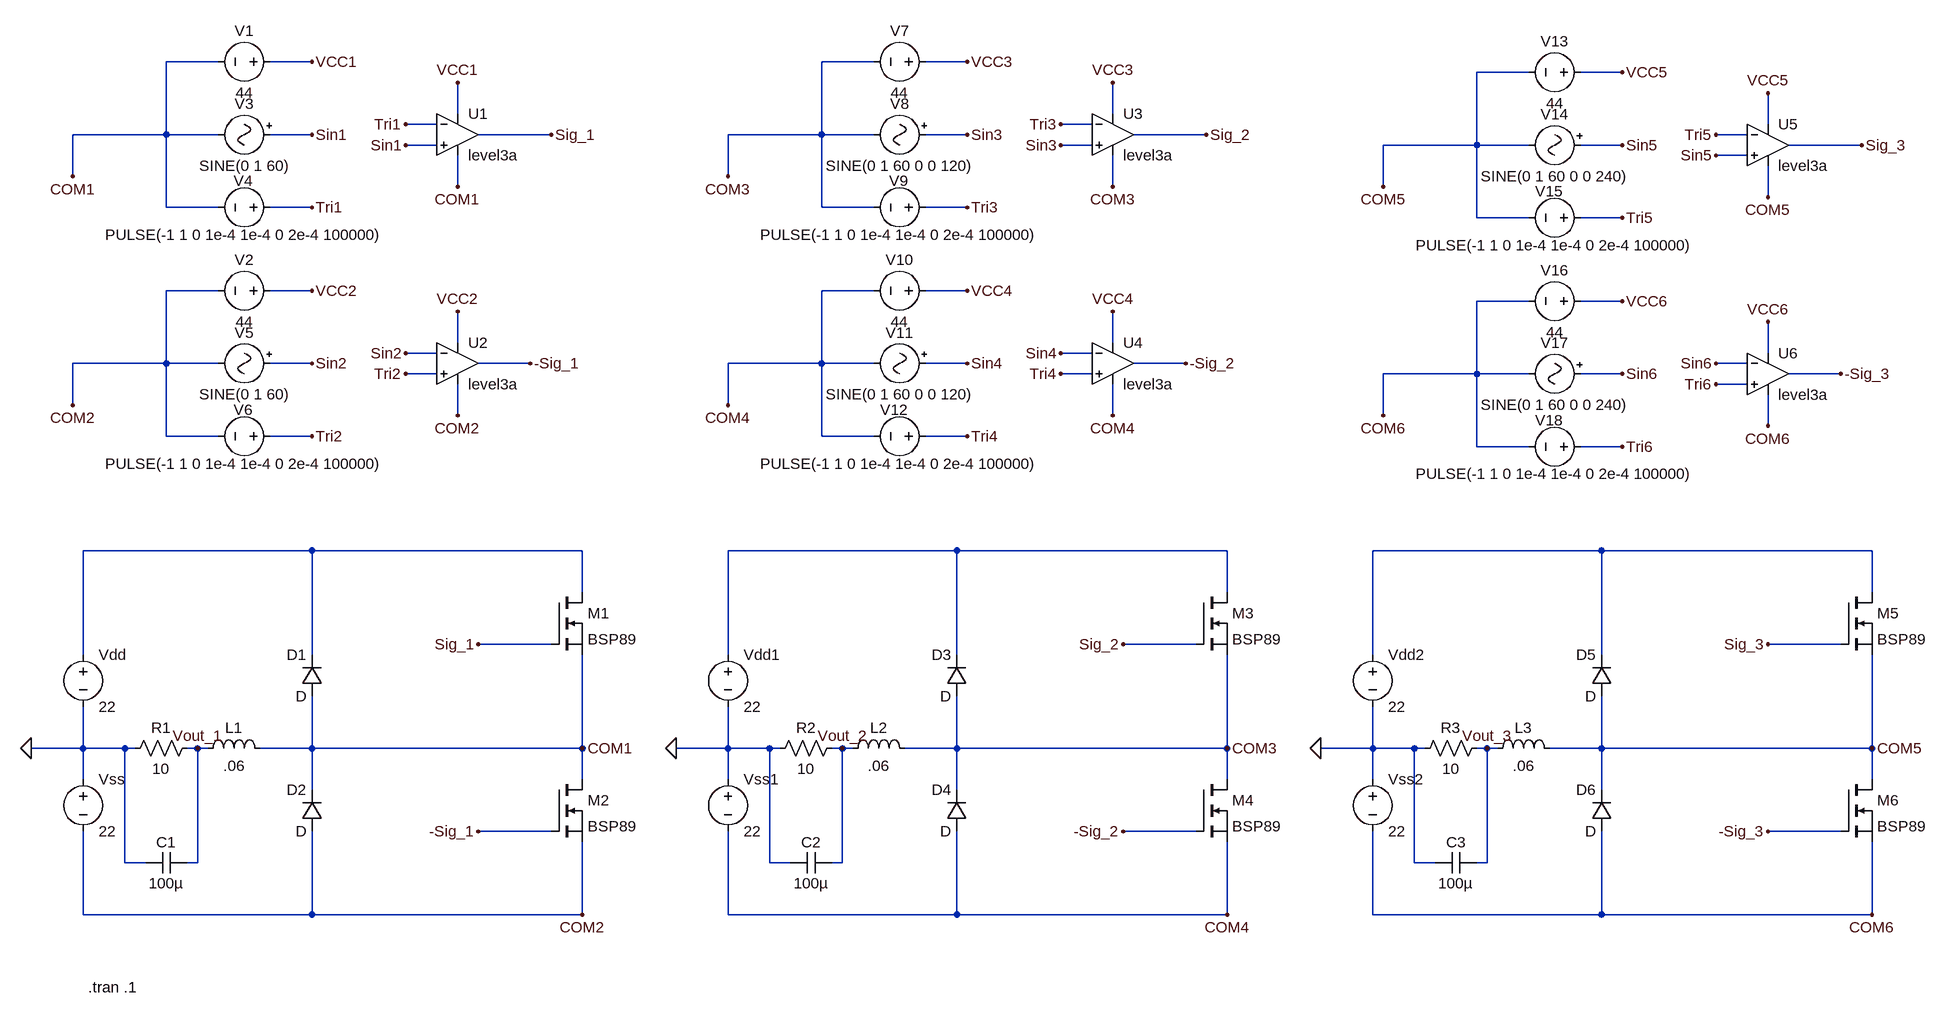
[diagram p0: schematic working_three_phase_inv_w9.asc]
working_three_phase_inv_w9.asc, the LTspice schematic file:
Version 4
SHEET 1 2928 2500
WIRE 272 352 192 352
WIRE 416 352 352 352
WIRE 1280 352 1200 352
WIRE 1424 352 1360 352
WIRE 2288 368 2208 368
WIRE 2432 368 2368 368
WIRE 640 432 640 384
WIRE 1648 432 1648 384
WIRE 608 448 560 448
WIRE 1616 448 1568 448
WIRE 2656 448 2656 400
WIRE 192 464 192 352
WIRE 192 464 48 464
WIRE 272 464 192 464
WIRE 416 464 352 464
WIRE 784 464 672 464
WIRE 1200 464 1200 352
WIRE 1200 464 1056 464
WIRE 1280 464 1200 464
WIRE 1424 464 1360 464
WIRE 1792 464 1680 464
WIRE 2624 464 2576 464
WIRE 608 480 560 480
WIRE 1616 480 1568 480
WIRE 2208 480 2208 368
WIRE 2208 480 2064 480
WIRE 2288 480 2208 480
WIRE 2432 480 2368 480
WIRE 2800 480 2688 480
WIRE 2624 496 2576 496
WIRE 48 528 48 464
WIRE 1056 528 1056 464
WIRE 640 544 640 496
WIRE 1648 544 1648 496
WIRE 2064 544 2064 480
WIRE 2656 560 2656 512
WIRE 192 576 192 464
WIRE 272 576 192 576
WIRE 416 576 352 576
WIRE 1200 576 1200 464
WIRE 1280 576 1200 576
WIRE 1424 576 1360 576
WIRE 2208 592 2208 480
WIRE 2288 592 2208 592
WIRE 2432 592 2368 592
WIRE 272 704 192 704
WIRE 416 704 352 704
WIRE 1280 704 1200 704
WIRE 1424 704 1360 704
WIRE 2288 720 2208 720
WIRE 2432 720 2368 720
WIRE 640 784 640 736
WIRE 1648 784 1648 736
WIRE 608 800 560 800
WIRE 1616 800 1568 800
WIRE 2656 800 2656 752
WIRE 192 816 192 704
WIRE 192 816 48 816
WIRE 272 816 192 816
WIRE 416 816 352 816
WIRE 752 816 672 816
WIRE 1200 816 1200 704
WIRE 1200 816 1056 816
WIRE 1280 816 1200 816
WIRE 1424 816 1360 816
WIRE 1760 816 1680 816
WIRE 2624 816 2576 816
WIRE 608 832 560 832
WIRE 1616 832 1568 832
WIRE 2208 832 2208 720
WIRE 2208 832 2064 832
WIRE 2288 832 2208 832
WIRE 2432 832 2368 832
WIRE 2768 832 2688 832
WIRE 2624 848 2576 848
WIRE 48 880 48 816
WIRE 1056 880 1056 816
WIRE 640 896 640 848
WIRE 1648 896 1648 848
WIRE 2064 896 2064 832
WIRE 2656 912 2656 864
WIRE 192 928 192 816
WIRE 272 928 192 928
WIRE 416 928 352 928
WIRE 1200 928 1200 816
WIRE 1280 928 1200 928
WIRE 1424 928 1360 928
WIRE 2208 944 2208 832
WIRE 2288 944 2208 944
WIRE 2432 944 2368 944
WIRE 416 1104 64 1104
WIRE 832 1104 416 1104
WIRE 1408 1104 1056 1104
WIRE 1824 1104 1408 1104
WIRE 2400 1104 2048 1104
WIRE 2816 1104 2400 1104
WIRE 832 1168 832 1104
WIRE 1824 1168 1824 1104
WIRE 2816 1168 2816 1104
WIRE 784 1248 672 1248
WIRE 1776 1248 1664 1248
WIRE 2768 1248 2656 1248
WIRE 64 1264 64 1104
WIRE 416 1264 416 1104
WIRE 1056 1264 1056 1104
WIRE 1408 1264 1408 1104
WIRE 2048 1264 2048 1104
WIRE 2400 1264 2400 1104
WIRE 64 1408 64 1344
WIRE 64 1408 -16 1408
WIRE 128 1408 64 1408
WIRE 144 1408 128 1408
WIRE 240 1408 224 1408
WIRE 256 1408 240 1408
WIRE 416 1408 416 1328
WIRE 416 1408 336 1408
WIRE 832 1408 832 1264
WIRE 832 1408 416 1408
WIRE 1056 1408 1056 1344
WIRE 1056 1408 976 1408
WIRE 1120 1408 1056 1408
WIRE 1136 1408 1120 1408
WIRE 1232 1408 1216 1408
WIRE 1248 1408 1232 1408
WIRE 1408 1408 1408 1328
WIRE 1408 1408 1328 1408
WIRE 1824 1408 1824 1264
WIRE 1824 1408 1408 1408
WIRE 2048 1408 2048 1344
WIRE 2048 1408 1968 1408
WIRE 2112 1408 2048 1408
WIRE 2128 1408 2112 1408
WIRE 2224 1408 2208 1408
WIRE 2240 1408 2224 1408
WIRE 2400 1408 2400 1328
WIRE 2400 1408 2320 1408
WIRE 2816 1408 2816 1264
WIRE 2816 1408 2400 1408
WIRE 64 1456 64 1408
WIRE 832 1456 832 1408
WIRE 1056 1456 1056 1408
WIRE 1824 1456 1824 1408
WIRE 2048 1456 2048 1408
WIRE 2816 1456 2816 1408
WIRE 416 1472 416 1408
WIRE 1408 1472 1408 1408
WIRE 2400 1472 2400 1408
WIRE 784 1536 672 1536
WIRE 1776 1536 1664 1536
WIRE 2768 1536 2656 1536
WIRE 128 1584 128 1408
WIRE 160 1584 128 1584
WIRE 240 1584 240 1408
WIRE 240 1584 224 1584
WIRE 1120 1584 1120 1408
WIRE 1152 1584 1120 1584
WIRE 1232 1584 1232 1408
WIRE 1232 1584 1216 1584
WIRE 2112 1584 2112 1408
WIRE 2144 1584 2112 1584
WIRE 2224 1584 2224 1408
WIRE 2224 1584 2208 1584
WIRE 64 1664 64 1536
WIRE 416 1664 416 1536
WIRE 416 1664 64 1664
WIRE 832 1664 832 1552
WIRE 832 1664 416 1664
WIRE 1056 1664 1056 1536
WIRE 1408 1664 1408 1536
WIRE 1408 1664 1056 1664
WIRE 1824 1664 1824 1552
WIRE 1824 1664 1408 1664
WIRE 2048 1664 2048 1536
WIRE 2400 1664 2400 1536
WIRE 2400 1664 2048 1664
WIRE 2816 1664 2816 1552
WIRE 2816 1664 2400 1664
FLAG -16 1408 0
FLAG 560 480 Sin1
FLAG 560 448 Tri1
FLAG 560 832 Tri2
FLAG 560 800 Sin2
FLAG 784 464 Sig_1
FLAG 752 816 -Sig_1
FLAG 640 384 VCC1
FLAG 640 736 VCC2
FLAG 640 544 COM1
FLAG 640 896 COM2
FLAG 832 1408 COM1
FLAG 832 1664 COM2
FLAG 416 352 VCC1
FLAG 416 464 Sin1
FLAG 416 576 Tri1
FLAG 48 528 COM1
FLAG 240 1408 Vout_1
FLAG 416 704 VCC2
FLAG 416 816 Sin2
FLAG 416 928 Tri2
FLAG 48 880 COM2
FLAG 672 1248 Sig_1
FLAG 672 1536 -Sig_1
FLAG 976 1408 0
FLAG 1824 1408 COM3
FLAG 1824 1664 COM4
FLAG 1232 1408 Vout_2
FLAG 1664 1248 Sig_2
FLAG 1664 1536 -Sig_2
FLAG 1568 480 Sin3
FLAG 1568 448 Tri3
FLAG 1568 832 Tri4
FLAG 1568 800 Sin4
FLAG 1792 464 Sig_2
FLAG 1760 816 -Sig_2
FLAG 1648 384 VCC3
FLAG 1648 736 VCC4
FLAG 1648 544 COM3
FLAG 1648 896 COM4
FLAG 1424 352 VCC3
FLAG 1424 464 Sin3
FLAG 1424 576 Tri3
FLAG 1056 528 COM3
FLAG 1424 704 VCC4
FLAG 1424 816 Sin4
FLAG 1424 928 Tri4
FLAG 1056 880 COM4
FLAG 2576 496 Sin5
FLAG 2576 464 Tri5
FLAG 2576 848 Tri6
FLAG 2576 816 Sin6
FLAG 2800 480 Sig_3
FLAG 2768 832 -Sig_3
FLAG 2656 400 VCC5
FLAG 2656 752 VCC6
FLAG 2656 560 COM5
FLAG 2656 912 COM6
FLAG 2432 368 VCC5
FLAG 2432 480 Sin5
FLAG 2432 592 Tri5
FLAG 2064 544 COM5
FLAG 2432 720 VCC6
FLAG 2432 832 Sin6
FLAG 2432 944 Tri6
FLAG 2064 896 COM6
FLAG 1968 1408 0
FLAG 2816 1408 COM5
FLAG 2816 1664 COM6
FLAG 2224 1408 Vout_3
FLAG 2656 1248 Sig_3
FLAG 2656 1536 -Sig_3
SYMBOL voltage 64 1248 R0
SYMATTR InstName Vdd
SYMATTR Value 22
SYMBOL voltage 64 1440 R0
SYMATTR InstName Vss
SYMATTR Value 22
SYMBOL Diode 432 1328 R180
WINDOW 0 24 64 Left 2
WINDOW 3 24 0 Left 2
SYMATTR InstName D1
SYMBOL Diode 432 1536 R180
WINDOW 0 24 64 Left 2
WINDOW 3 24 0 Left 2
SYMATTR InstName D2
SYMBOL nmos 784 1168 R0
SYMATTR InstName M1
SYMATTR Value BSP89
SYMBOL nmos 784 1456 R0
SYMATTR InstName M2
SYMATTR Value BSP89
SYMBOL Res 240 1392 R90
WINDOW 0 0 56 VBottom 2
WINDOW 3 32 56 VTop 2
SYMATTR InstName R1
SYMATTR Value 10
SYMBOL ind 240 1424 R270
WINDOW 0 32 56 VTop 2
WINDOW 3 5 56 VBottom 2
SYMATTR InstName L1
SYMATTR Value .06
SYMBOL cap 224 1568 R90
WINDOW 0 0 32 VBottom 2
WINDOW 3 32 32 VTop 2
SYMATTR InstName C1
SYMATTR Value 100µ
SYMBOL voltage 368 352 R90
WINDOW 0 -32 56 VBottom 2
WINDOW 3 32 56 VTop 2
WINDOW 123 0 0 Left 0
WINDOW 39 0 0 Left 0
SYMATTR InstName V1
SYMATTR Value 44
SYMBOL signal 368 464 R90
WINDOW 0 -32 56 VBottom 2
WINDOW 3 32 56 VTop 2
WINDOW 123 0 0 Left 0
WINDOW 39 0 0 Left 0
SYMATTR InstName V3
SYMATTR Value SINE(0 1 60)
SYMBOL voltage 368 576 R90
WINDOW 123 0 0 Left 0
WINDOW 39 0 0 Left 0
WINDOW 0 -41 43 VRight 2
WINDOW 3 42 -161 VRight 2
SYMATTR InstName V4
SYMATTR Value PULSE(-1 1 0 1e-4 1e-4 0 2e-4 100000)
SYMBOL voltage 368 704 R90
WINDOW 0 -32 56 VBottom 2
WINDOW 3 32 56 VTop 2
WINDOW 123 0 0 Left 0
WINDOW 39 0 0 Left 0
SYMATTR InstName V2
SYMATTR Value 44
SYMBOL signal 368 816 R90
WINDOW 0 -32 56 VBottom 2
WINDOW 3 32 56 VTop 2
WINDOW 123 0 0 Left 0
WINDOW 39 0 0 Left 0
SYMATTR InstName V5
SYMATTR Value SINE(0 1 60)
SYMBOL voltage 368 928 R90
WINDOW 123 0 0 Left 0
WINDOW 39 0 0 Left 0
WINDOW 0 -41 43 VRight 2
WINDOW 3 42 -161 VRight 2
SYMATTR InstName V6
SYMATTR Value PULSE(-1 1 0 1e-4 1e-4 0 2e-4 100000)
SYMBOL OpAmps/UniversalOpAmp3 640 464 R0
SYMATTR InstName U1
SYMBOL OpAmps/UniversalOpAmp3 640 816 R0
SYMATTR InstName U2
SYMBOL voltage 1056 1248 R0
SYMATTR InstName Vdd1
SYMATTR Value 22
SYMBOL voltage 1056 1440 R0
SYMATTR InstName Vss1
SYMATTR Value 22
SYMBOL Diode 1424 1328 R180
WINDOW 0 24 64 Left 2
WINDOW 3 24 0 Left 2
SYMATTR InstName D3
SYMBOL Diode 1424 1536 R180
WINDOW 0 24 64 Left 2
WINDOW 3 24 0 Left 2
SYMATTR InstName D4
SYMBOL nmos 1776 1168 R0
SYMATTR InstName M3
SYMATTR Value BSP89
SYMBOL nmos 1776 1456 R0
SYMATTR InstName M4
SYMATTR Value BSP89
SYMBOL Res 1232 1392 R90
WINDOW 0 0 56 VBottom 2
WINDOW 3 32 56 VTop 2
SYMATTR InstName R2
SYMATTR Value 10
SYMBOL ind 1232 1424 R270
WINDOW 0 32 56 VTop 2
WINDOW 3 5 56 VBottom 2
SYMATTR InstName L2
SYMATTR Value .06
SYMBOL cap 1216 1568 R90
WINDOW 0 0 32 VBottom 2
WINDOW 3 32 32 VTop 2
SYMATTR InstName C2
SYMATTR Value 100µ
SYMBOL voltage 1376 352 R90
WINDOW 0 -32 56 VBottom 2
WINDOW 3 32 56 VTop 2
WINDOW 123 0 0 Left 0
WINDOW 39 0 0 Left 0
SYMATTR InstName V7
SYMATTR Value 44
SYMBOL signal 1376 464 R90
WINDOW 0 -32 56 VBottom 2
WINDOW 3 32 56 VTop 2
WINDOW 123 0 0 Left 0
WINDOW 39 0 0 Left 0
SYMATTR InstName V8
SYMATTR Value SINE(0 1 60 0 0 120)
SYMBOL voltage 1376 576 R90
WINDOW 123 0 0 Left 0
WINDOW 39 0 0 Left 0
WINDOW 0 -41 43 VRight 2
WINDOW 3 42 -161 VRight 2
SYMATTR InstName V9
SYMATTR Value PULSE(-1 1 0 1e-4 1e-4 0 2e-4 100000)
SYMBOL voltage 1376 704 R90
WINDOW 0 -32 56 VBottom 2
WINDOW 3 32 56 VTop 2
WINDOW 123 0 0 Left 0
WINDOW 39 0 0 Left 0
SYMATTR InstName V10
SYMATTR Value 44
SYMBOL signal 1376 816 R90
WINDOW 0 -32 56 VBottom 2
WINDOW 3 32 56 VTop 2
WINDOW 123 0 0 Left 0
WINDOW 39 0 0 Left 0
SYMATTR InstName V11
SYMATTR Value SINE(0 1 60 0 0 120)
SYMBOL voltage 1376 928 R90
WINDOW 123 0 0 Left 0
WINDOW 39 0 0 Left 0
WINDOW 0 -41 43 VRight 2
WINDOW 3 42 -161 VRight 2
SYMATTR InstName V12
SYMATTR Value PULSE(-1 1 0 1e-4 1e-4 0 2e-4 100000)
SYMBOL OpAmps/UniversalOpAmp3 1648 464 R0
SYMATTR InstName U3
SYMBOL OpAmps/UniversalOpAmp3 1648 816 R0
SYMATTR InstName U4
SYMBOL voltage 2384 368 R90
WINDOW 0 -32 56 VBottom 2
WINDOW 3 32 56 VTop 2
WINDOW 123 0 0 Left 0
WINDOW 39 0 0 Left 0
SYMATTR InstName V13
SYMATTR Value 44
SYMBOL signal 2384 480 R90
WINDOW 0 -32 56 VBottom 2
WINDOW 3 32 56 VTop 2
WINDOW 123 0 0 Left 0
WINDOW 39 0 0 Left 0
SYMATTR InstName V14
SYMATTR Value SINE(0 1 60 0 0 240)
SYMBOL voltage 2384 592 R90
WINDOW 123 0 0 Left 0
WINDOW 39 0 0 Left 0
WINDOW 0 -41 43 VRight 2
WINDOW 3 42 -161 VRight 2
SYMATTR InstName V15
SYMATTR Value PULSE(-1 1 0 1e-4 1e-4 0 2e-4 100000)
SYMBOL voltage 2384 720 R90
WINDOW 0 -32 56 VBottom 2
WINDOW 3 32 56 VTop 2
WINDOW 123 0 0 Left 0
WINDOW 39 0 0 Left 0
SYMATTR InstName V16
SYMATTR Value 44
SYMBOL signal 2384 832 R90
WINDOW 0 -32 56 VBottom 2
WINDOW 3 32 56 VTop 2
WINDOW 123 0 0 Left 0
WINDOW 39 0 0 Left 0
SYMATTR InstName V17
SYMATTR Value SINE(0 1 60 0 0 240)
SYMBOL voltage 2384 944 R90
WINDOW 123 0 0 Left 0
WINDOW 39 0 0 Left 0
WINDOW 0 -41 43 VRight 2
WINDOW 3 42 -161 VRight 2
SYMATTR InstName V18
SYMATTR Value PULSE(-1 1 0 1e-4 1e-4 0 2e-4 100000)
SYMBOL OpAmps/UniversalOpAmp3 2656 480 R0
SYMATTR InstName U5
SYMBOL OpAmps/UniversalOpAmp3 2656 832 R0
SYMATTR InstName U6
SYMBOL voltage 2048 1248 R0
SYMATTR InstName Vdd2
SYMATTR Value 22
SYMBOL voltage 2048 1440 R0
SYMATTR InstName Vss2
SYMATTR Value 22
SYMBOL Diode 2416 1328 R180
WINDOW 0 24 64 Left 2
WINDOW 3 24 0 Left 2
SYMATTR InstName D5
SYMBOL Diode 2416 1536 R180
WINDOW 0 24 64 Left 2
WINDOW 3 24 0 Left 2
SYMATTR InstName D6
SYMBOL nmos 2768 1168 R0
SYMATTR InstName M5
SYMATTR Value BSP89
SYMBOL nmos 2768 1456 R0
SYMATTR InstName M6
SYMATTR Value BSP89
SYMBOL Res 2224 1392 R90
WINDOW 0 0 56 VBottom 2
WINDOW 3 32 56 VTop 2
SYMATTR InstName R3
SYMATTR Value 10
SYMBOL ind 2224 1424 R270
WINDOW 0 32 56 VTop 2
WINDOW 3 5 56 VBottom 2
SYMATTR InstName L3
SYMATTR Value .06
SYMBOL cap 2208 1568 R90
WINDOW 0 0 32 VBottom 2
WINDOW 3 32 32 VTop 2
SYMATTR InstName C3
SYMATTR Value 100µ
TEXT 72 1776 Left 2 !.tran .1

The netlist it stands for:
* working_three_phase_inv_w9.asc
Vdd N001 0 22
Vss 0 COM2 22
D1 COM1 N001 D
D2 COM2 COM1 D
M1 N001 Sig_1 COM1 COM1 BSP89
M2 COM1 -Sig_1 COM2 COM2 BSP89
R1 Vout_1 0 10
L1 Vout_1 COM1 .06
C1 Vout_1 0 100µ
V1 VCC1 COM1 44
V3 Sin1 COM1 SINE(0 1 60)
V4 Tri1 COM1 PULSE(-1 1 0 1e-4 1e-4 0 2e-4 100000)
V2 VCC2 COM2 44
V5 Sin2 COM2 SINE(0 1 60)
V6 Tri2 COM2 PULSE(-1 1 0 1e-4 1e-4 0 2e-4 100000)
XU1 Sin1 Tri1 VCC1 COM1 Sig_1 level3a  ; pins In+ In- V+ V- OUT
XU2 Tri2 Sin2 VCC2 COM2 -Sig_1 level3a  ; pins In+ In- V+ V- OUT
Vdd1 N002 0 22
Vss1 0 COM4 22
D3 COM3 N002 D
D4 COM4 COM3 D
M3 N002 Sig_2 COM3 COM3 BSP89
M4 COM3 -Sig_2 COM4 COM4 BSP89
R2 Vout_2 0 10
L2 Vout_2 COM3 .06
C2 Vout_2 0 100µ
V7 VCC3 COM3 44
V8 Sin3 COM3 SINE(0 1 60 0 0 120)
V9 Tri3 COM3 PULSE(-1 1 0 1e-4 1e-4 0 2e-4 100000)
V10 VCC4 COM4 44
V11 Sin4 COM4 SINE(0 1 60 0 0 120)
V12 Tri4 COM4 PULSE(-1 1 0 1e-4 1e-4 0 2e-4 100000)
XU3 Sin3 Tri3 VCC3 COM3 Sig_2 level3a  ; pins In+ In- V+ V- OUT
XU4 Tri4 Sin4 VCC4 COM4 -Sig_2 level3a  ; pins In+ In- V+ V- OUT
V13 VCC5 COM5 44
V14 Sin5 COM5 SINE(0 1 60 0 0 240)
V15 Tri5 COM5 PULSE(-1 1 0 1e-4 1e-4 0 2e-4 100000)
V16 VCC6 COM6 44
V17 Sin6 COM6 SINE(0 1 60 0 0 240)
V18 Tri6 COM6 PULSE(-1 1 0 1e-4 1e-4 0 2e-4 100000)
XU5 Sin5 Tri5 VCC5 COM5 Sig_3 level3a  ; pins In+ In- V+ V- OUT
XU6 Tri6 Sin6 VCC6 COM6 -Sig_3 level3a  ; pins In+ In- V+ V- OUT
Vdd2 N003 0 22
Vss2 0 COM6 22
D5 COM5 N003 D
D6 COM6 COM5 D
M5 N003 Sig_3 COM5 COM5 BSP89
M6 COM5 -Sig_3 COM6 COM6 BSP89
R3 Vout_3 0 10
L3 Vout_3 COM5 .06
C3 Vout_3 0 100µ
.model D D
.lib standard.dio
.model NMOS NMOS
.model PMOS PMOS
.lib standard.mos
.tran .1
.backanno
.end